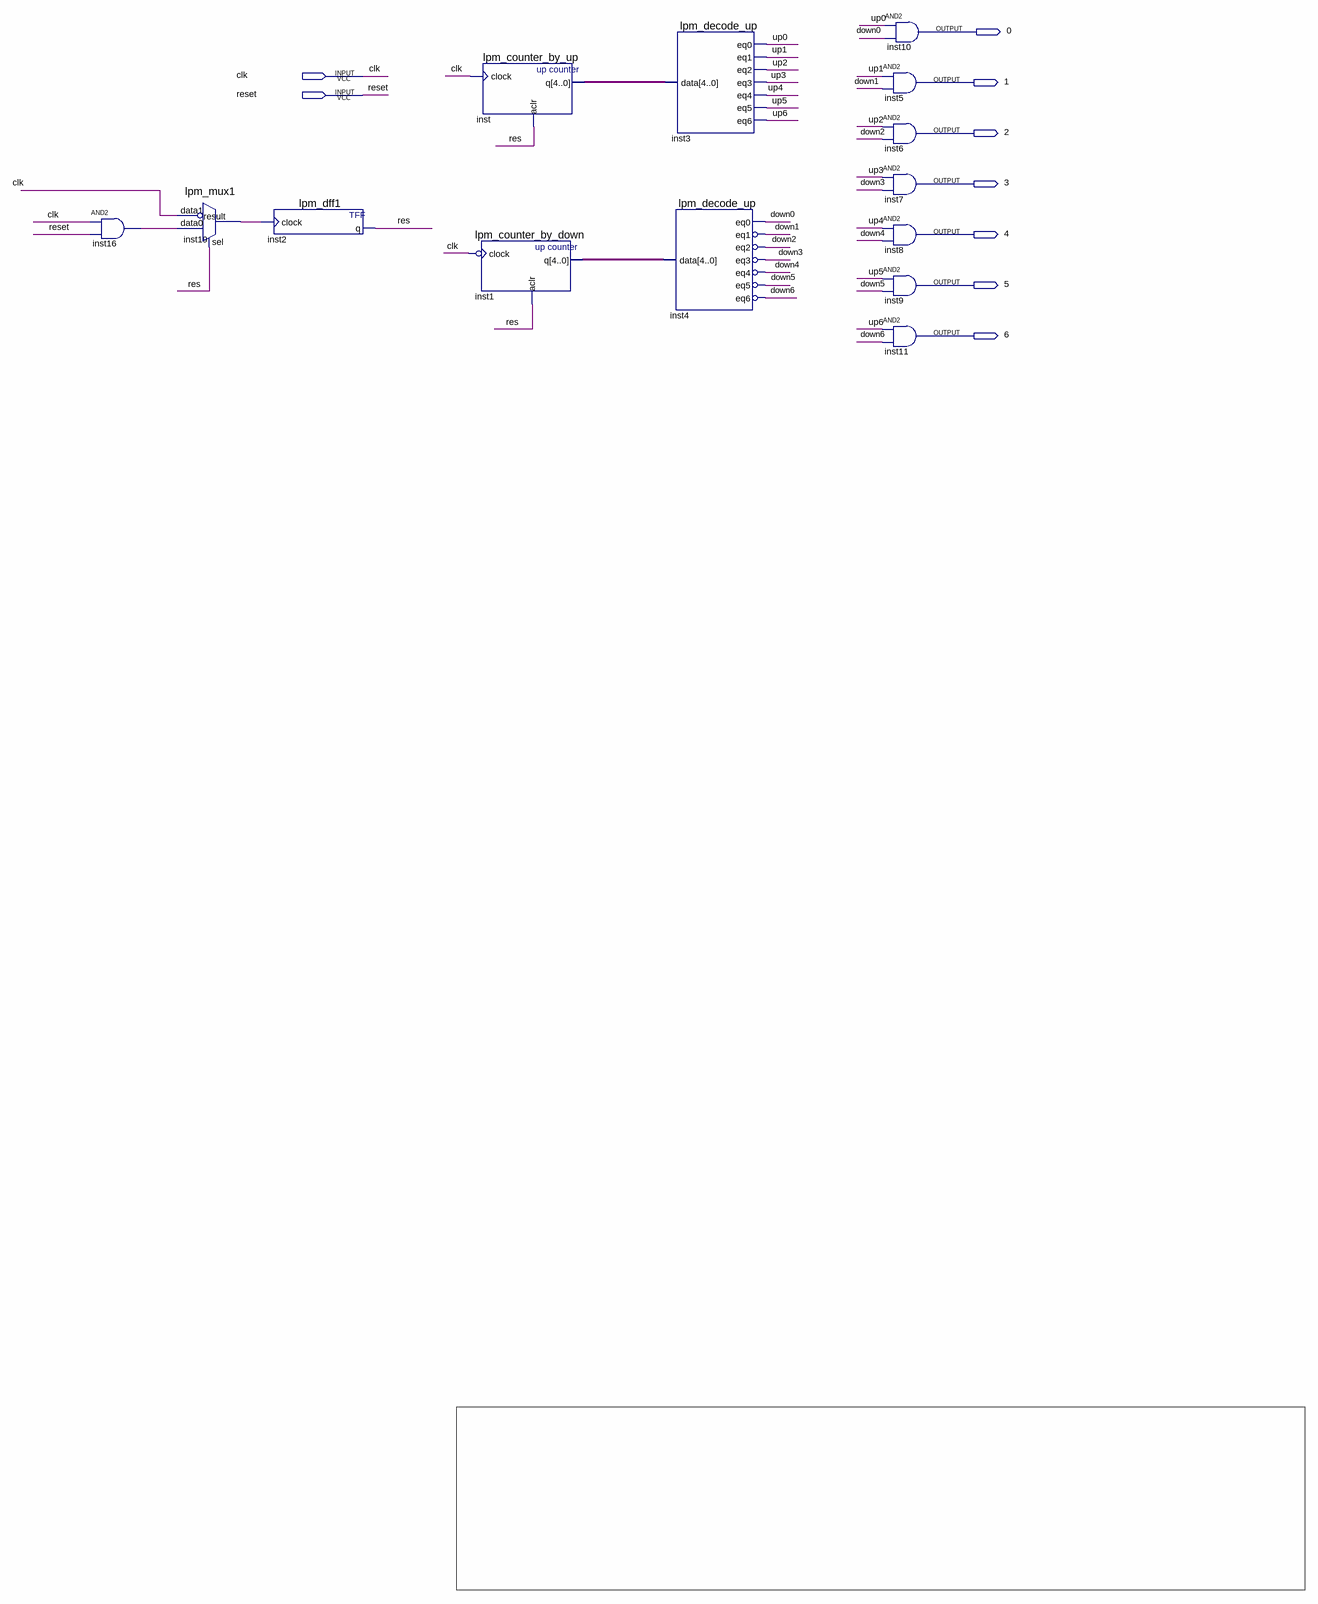
[diagram p0: schematic sheet]
// Quartus schematic DCa.bdf as structural Verilog: 14 symbols, 9 pins
module DCa (
  input  clk,
  input  reset,
  output \0 ,
  output \1 ,
  output \2 ,
  output \3 ,
  output \4 ,
  output \5 ,
  output \6 
);

  wire down0, down1, down2, down3, down4, down5, down6, inst4_eq1, inst4_eq2, inst4_eq3, inst4_eq4,
       inst4_eq5, inst4_eq6, inst16_out, inst19_result, res, up0, up1, up2, up3, up4, up5, up6;
  wire [4:0] inst1_q, inst_q;

  and inst16 (inst16_out, clk, reset);
  lpm_mux1 inst19 (.data1(~clk), .data0(inst16_out), .sel(res), .result(inst19_result));
  lpm_dff1 inst2 (.clock(inst19_result), .q(res));
  lpm_counter_by_up inst (.clock(clk), .aclr(res), .q(inst_q));
  lpm_counter_by_down inst1 (.clock(~clk), .aclr(res), .q(inst1_q));
  lpm_decode_up inst3 (.data(inst_q), .eq0(up0), .eq1(up1), .eq2(up2), .eq3(up3), .eq4(up4), .eq5(up5), .eq6(up6));
  lpm_decode_up inst4 (
    .data(inst1_q), .eq0(down0), .eq1(inst4_eq1), .eq2(inst4_eq2), .eq3(inst4_eq3), .eq4(inst4_eq4),
    .eq5(inst4_eq5), .eq6(inst4_eq6));
  not inst4_eq1_inverted (down1, inst4_eq1);
  not inst4_eq2_inverted (down2, inst4_eq2);
  not inst4_eq3_inverted (down3, inst4_eq3);
  not inst4_eq4_inverted (down4, inst4_eq4);
  not inst4_eq5_inverted (down5, inst4_eq5);
  not inst4_eq6_inverted (down6, inst4_eq6);
  and inst10 (\0 , up0, down0);
  and inst5 (\1 , up1, down1);
  and inst6 (\2 , up2, down2);
  and inst7 (\3 , up3, down3);
  and inst8 (\4 , up4, down4);
  and inst9 (\5 , up5, down5);
  and inst11 (\6 , up6, down6);
endmodule
